# Altium schematic sheet Main_Shield.SchDoc: LED Shield - Main schematic
size A4; DrawnBy: Bronson Philippa; Revision: 1; SheetNumber: 1; SheetTotal: 2
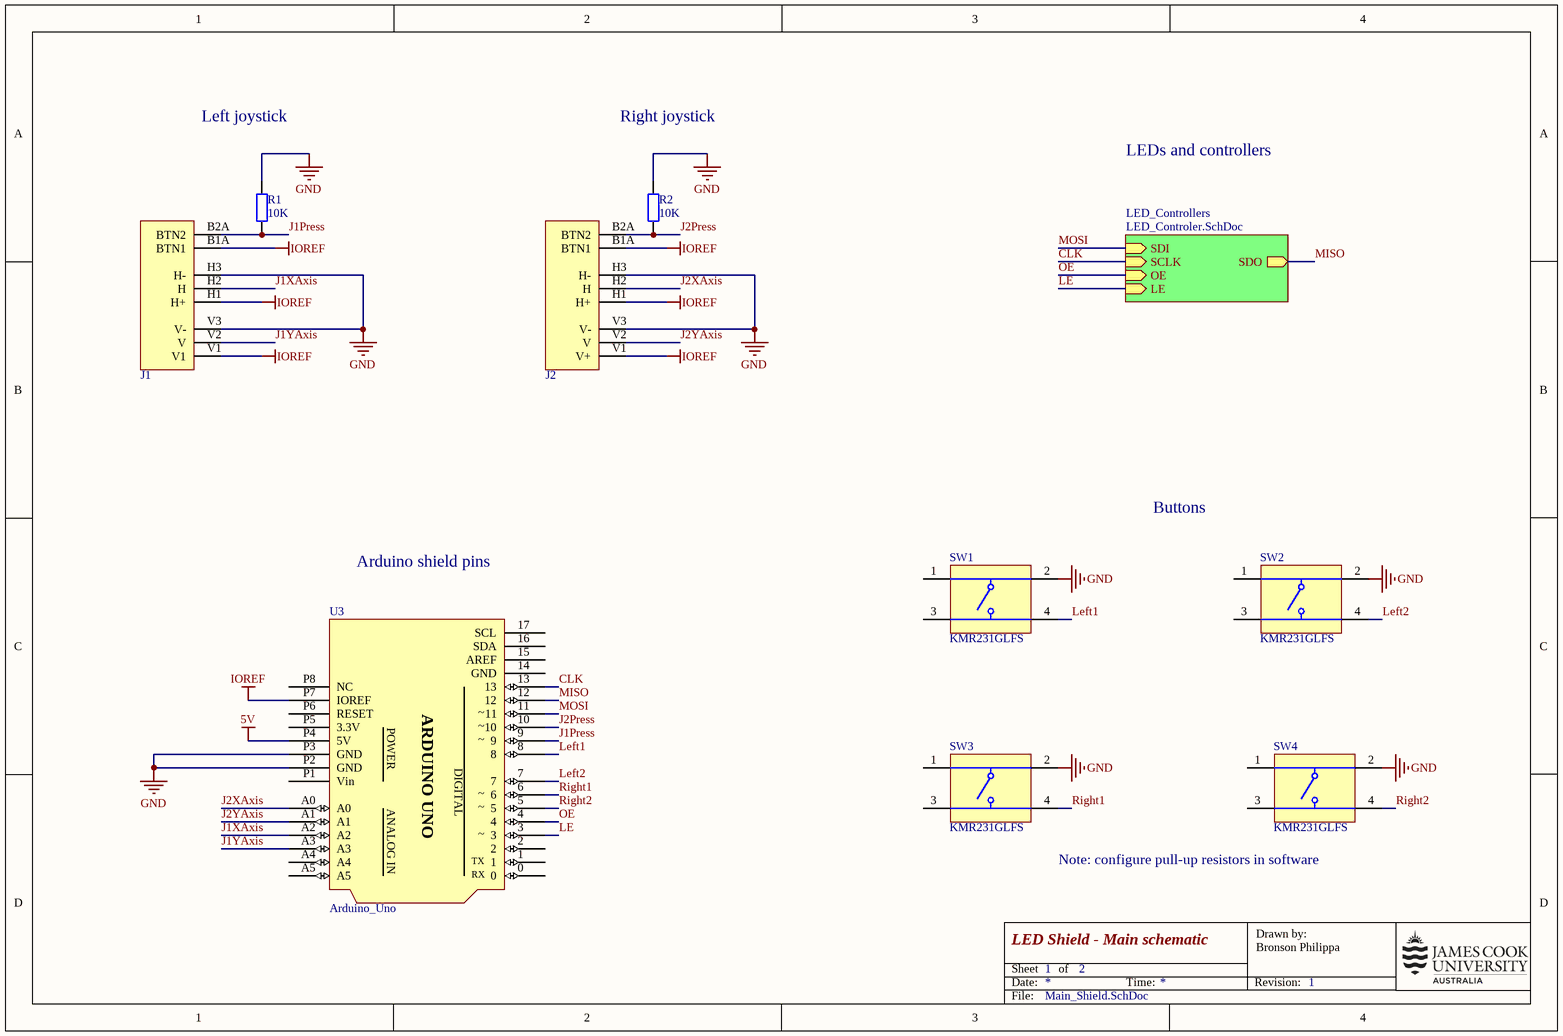
[diagram p0: Main_Shield.SchDoc]

## Parts
J1  Joystick  [JOYSTICK]  (value not drawn)
J2  Joystick  [JOYSTICK]  (value not drawn)
R1  value 10K  [AXIAL-0.4]  (hidden comment: Resistor Axial-0.4)
R2  value 10K  [AXIAL-0.4]  (hidden comment: Resistor Axial-0.4)
SW1  KMR231GLFS  [CKCP-KMR231GLFS]
SW2  KMR231GLFS  [CKCP-KMR231GLFS]
SW3  KMR231GLFS  [CKCP-KMR231GLFS]
SW4  KMR231GLFS  [CKCP-KMR231GLFS]
U3  Arduino_Uno  [ArduinoUnoR3]

## Sub-sheets
LED_Controllers = LED_Controler.SchDoc: SDO (out), SDI (in), SCLK (in), OE (in), LE (in)

## Nets
5V: U3.P4(5V)
GND: J1.H3(H-) J1.V3(V-) J2.H3(H-) J2.V3(V-) R1.1 R2.1 SW1.2 SW2.2 SW3.2 SW4.2 U3.P2(GND) U3.P3(GND)
IOREF: J1.B1A(BTN1) J1.H1(H+) J1.V1 J2.B1A(BTN1) J2.H1(H+) J2.V1(V+) U3.P7(IOREF)
CLK: U3.13 ; sheet LED_Controllers/SCLK
J1Press: J1.B2A(BTN2) R1.2 U3.9
J1XAxis: J1.H2(H) U3.A2
J1YAxis: J1.V2(V) U3.A3
J2Press: J2.B2A(BTN2) R2.2 U3.10
J2XAxis: J2.H2(H) U3.A0
J2YAxis: J2.V2(V) U3.A1
LE: U3.3 ; sheet LED_Controllers/LE
Left1: SW1.4 U3.8
Left2: SW2.4 U3.7
MISO: U3.12 ; sheet LED_Controllers/SDO
MOSI: U3.11 ; sheet LED_Controllers/SDI
OE: U3.4 ; sheet LED_Controllers/OE
Right1: SW3.4 U3.6
Right2: SW4.4 U3.5

Not connected (* = marked no-connect by the designer): SW1 1 3; SW2 1 3; SW3 1 3; SW4 1 3; U3 0 1 2 14(GND) 15(AREF) 16(SDA) 17(SCL) A4 A5 P1(Vin) P5(3.3V) P6(RESET) P8(NC)

## Notes on the sheet
- Left joystick
- Right joystick
- LEDs and controllers
- Buttons
- Arduino shield pins
- Note: configure pull-up resistors in software
- Date:
- Sheet
- of
- Time:
- Revision:
- Drawn by:
- File:
- (in symbol Arduino_Uno) ARDUINO UNO; ~; POWER; DIGITAL; ANALOG IN; TX; RX

## Library data of the parts
J1 J2 = Joystick: Sparkfun Joystick COM-09032
R1 R2 = Resistor Axial-0.4: Resistor; Published: 8-Jun-2000; LatestRevisionDate: 17-Jul-2002; LatestRevisionNote: Re-released for DXP Platform.; PackageReference: AXIAL-0.4; Publisher: Altium Limited; PackageDescription: Axial Device, Thru-Hole; 2 Leads; 0.4 in Pin Spacing
SW1-SW4 = CMP-2000-06516-1: Switch Tactile, SPST, 50 mA, 32 V, -40 to 85 degC, 4-Pin SMD, RoHS, Tape and Reel; Manufacturer: C&K Components; Mechanical Life: 150000Cycles; Switch Configuration: N.O.; Actuator Style: Button; Ground Terminal: Yes; Maximum DC Voltage Rating: 32V; Minimum Insulation Resistance: >=1000MOhm; Dielectric Strength: >=250Vrms; Operating Force: 3N; Illumination Type: N/R; Body Orientation: Straight; Contact Rating @ Voltage: 1A; Actuator Length: 0.5mm; Operating Temperature: -40to85C; Electrical Life: N/A; Housing Material: N/A; ECCN: EAR99; Pole Throw Configuration: SPST; Contact Plating: Silver; Dimension: 2.8x4.6x1.9mm; Type: Micro-Miniature; Product Weight: N/A; Package Description: 4-Pin Surface Mount Device, Body 4.6 x 2.8 mm; Actuator Color: N/A; HTS: 8536501199; Mounting Technology: SurfaceMount; Mounting: SurfaceMount,GullWing; Seal Location: N/A; Base Material: N/A; Family: KMR2; Part No: KMR231GLFS; Datasheet Version: 06/2016; Contact Material: Silver; Package Reference: KMR231GLFS; Manufacturer URL: http://www.ckswitches.com/; Maximum AC Voltage Rating: N/A; Datasheet URL: http://www.ck-components.com/media/1479/kmr2.pdf; RoHS: Yes; Seal Description: N/A; Packaging: TapeandReel; Supplier: C&KComponents
U3 = Arduino_Uno: Template for building an Arduino shield